# EAGLE schematic tf534 (EAGLE 8.7.0)

## Sheet 1 of 3
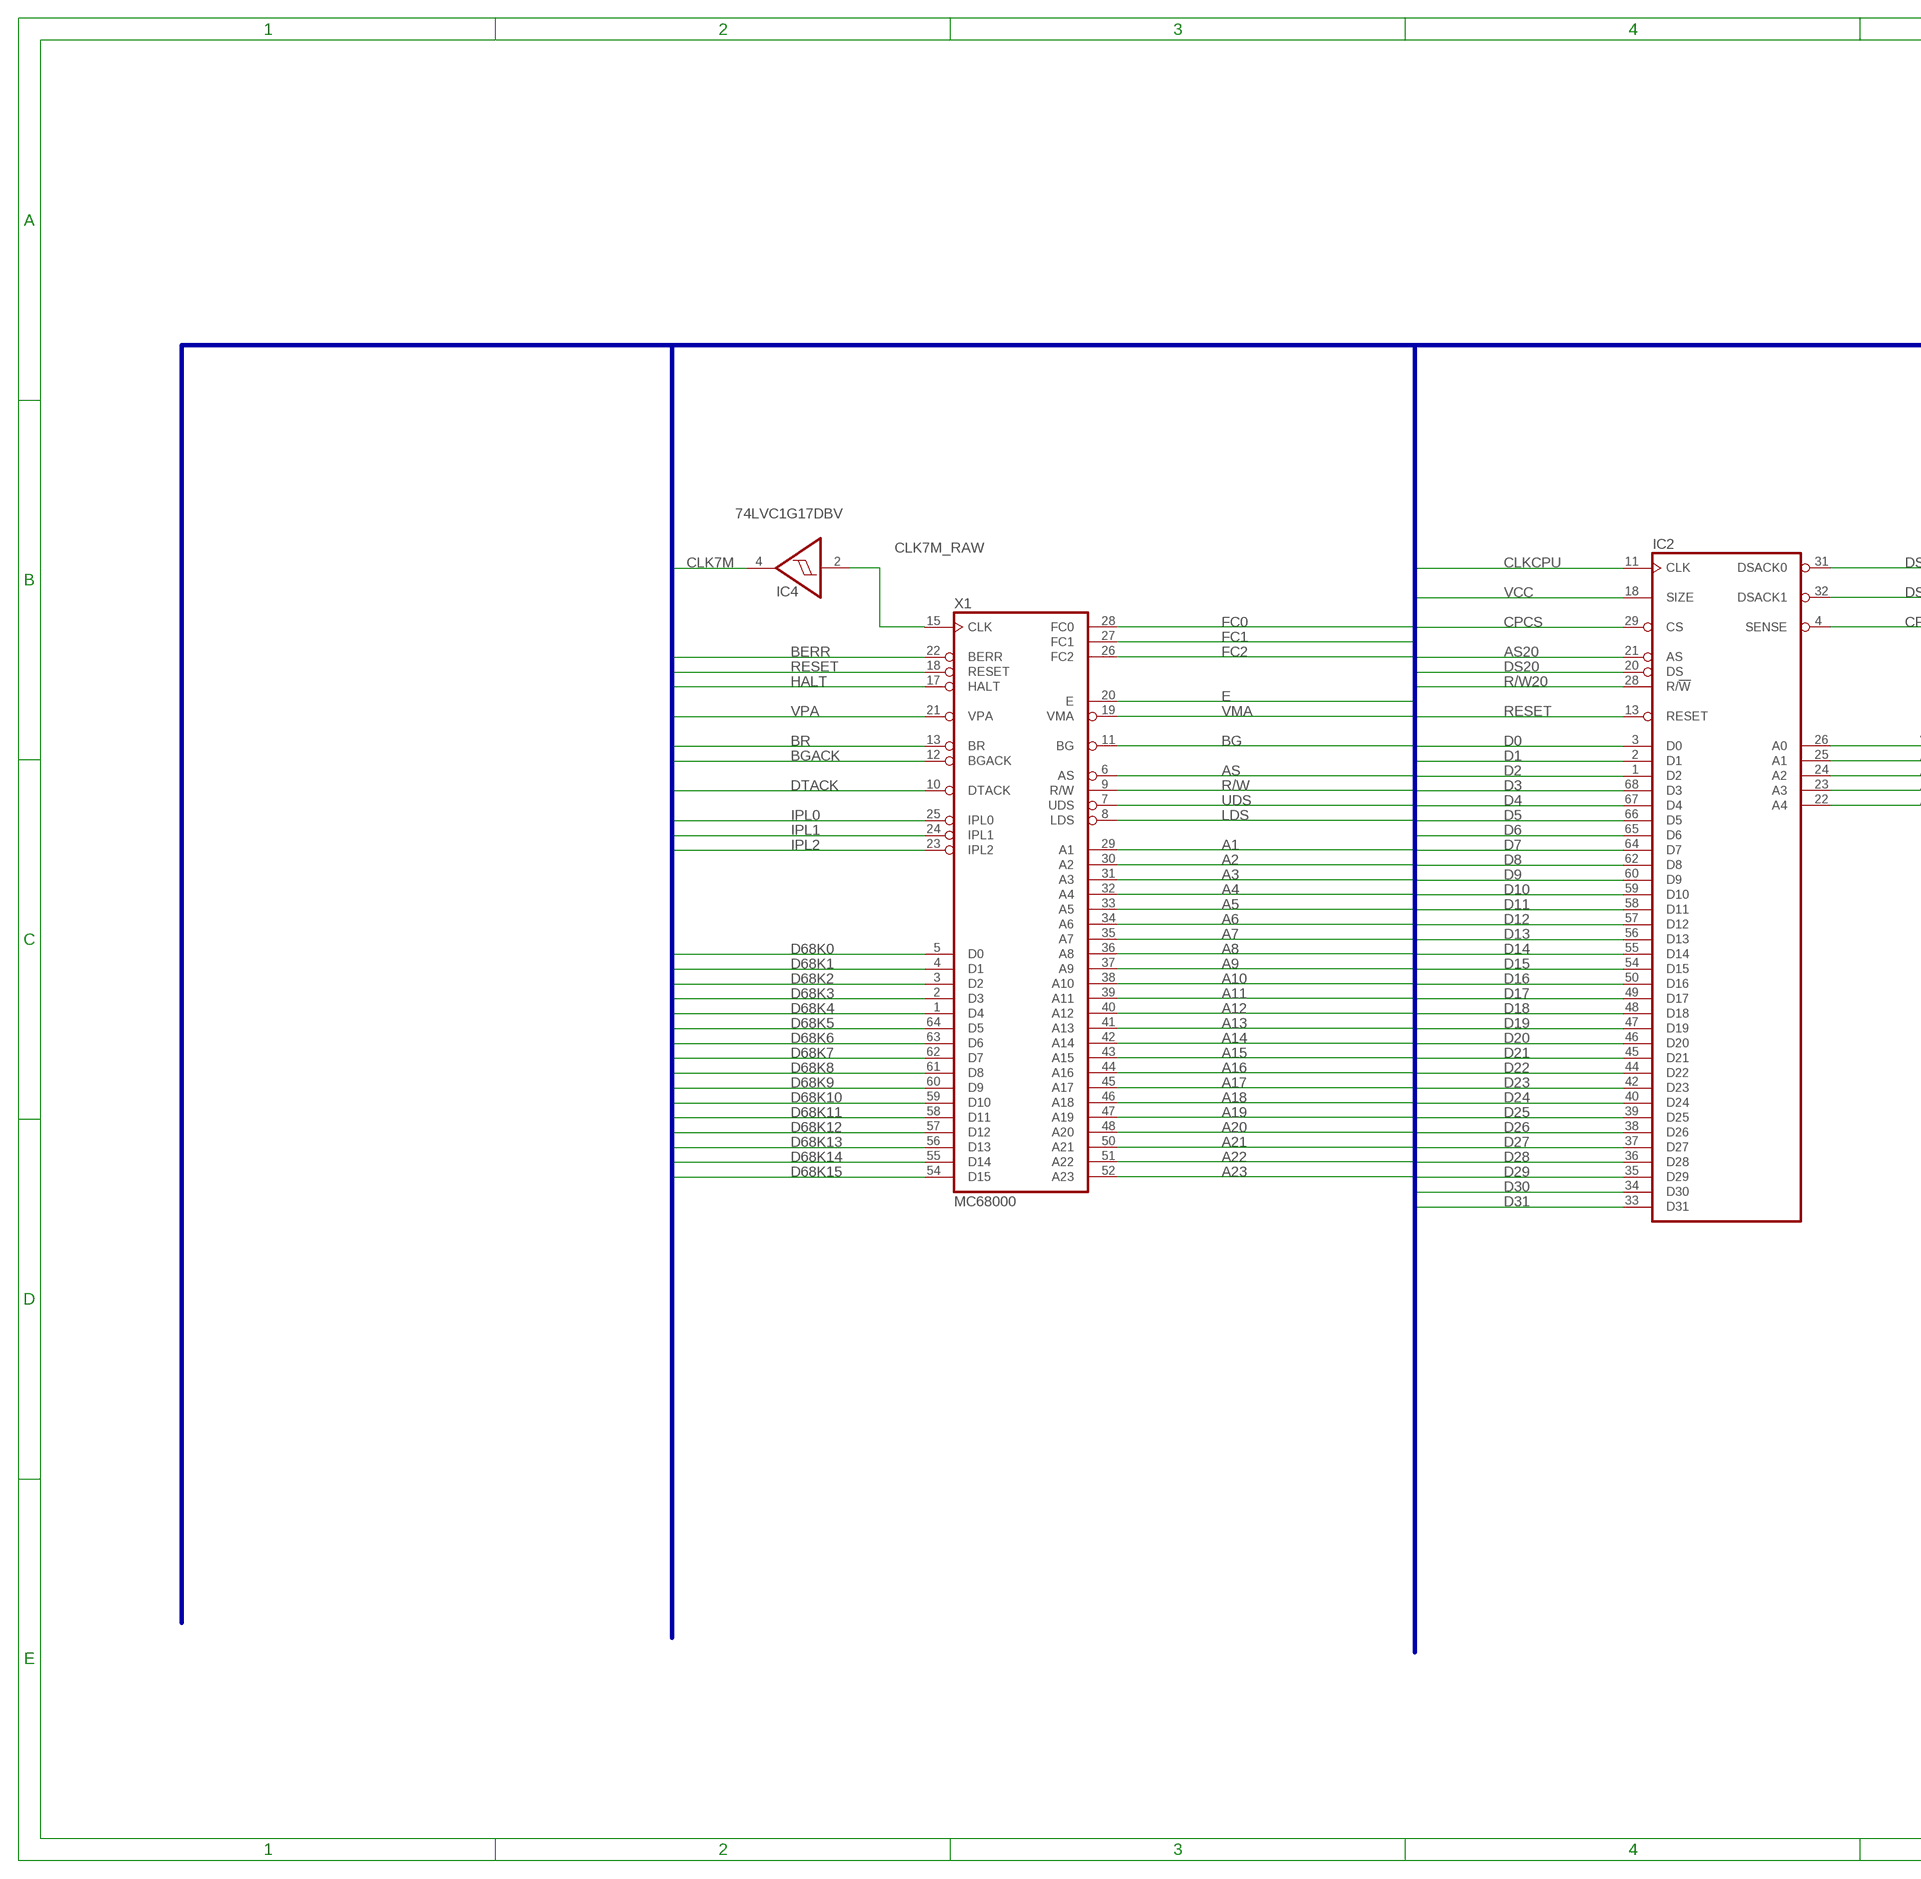
[diagram p0: schematic, sheet 1, part 1 of 2]
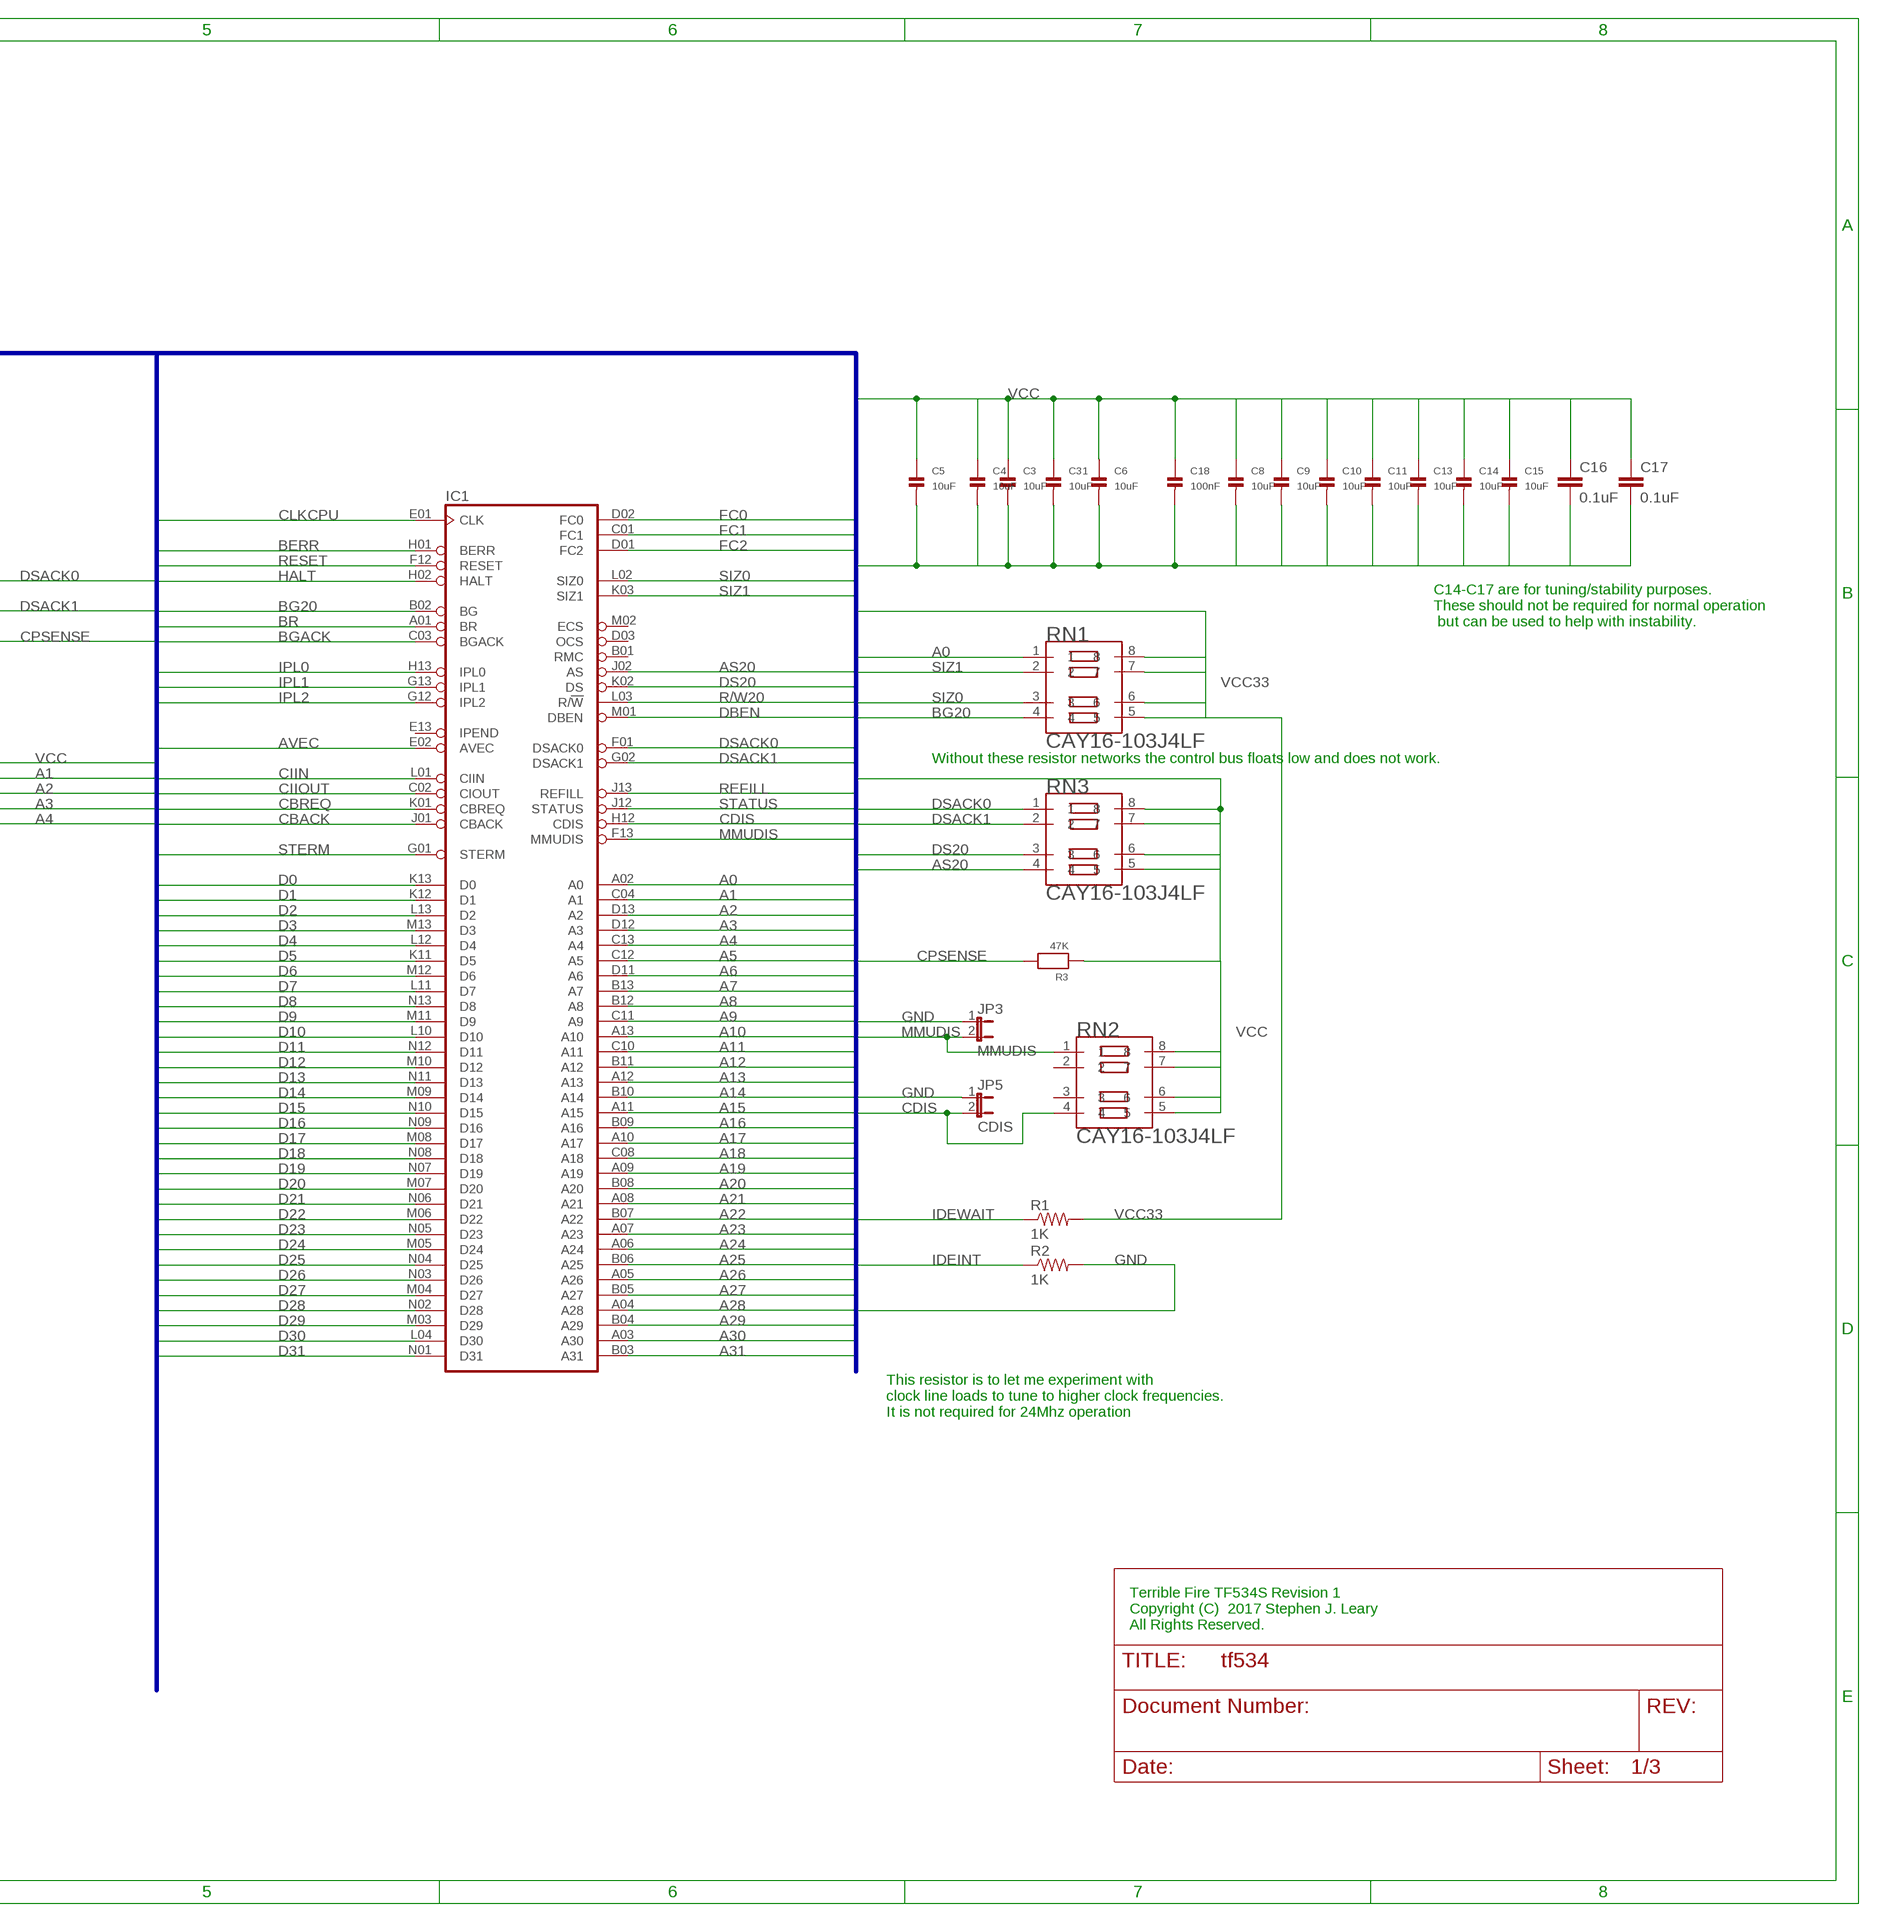
[diagram p1: schematic, sheet 1, part 2 of 2]

### Parts
C3  10uF  CAP_CERAMIC1206  [1206]
C4  10uF  CAP_CERAMIC1206  [1206]
C5  10uF  CAP_CERAMIC1206  [1206]
C6  10uF  CAP_CERAMIC1206  [1206]
C8  10uF  CAP_CERAMIC1206  [1206]
C9  10uF  CAP_CERAMIC1206  [1206]
C10  10uF  CAP_CERAMIC1206  [1206]
C11  10uF  CAP_CERAMIC1206  [1206]
C13  10uF  CAP_CERAMIC1206  [1206]
C14  10uF  CAP_CERAMIC1206  [1206]
C15  10uF  CAP_CERAMIC1206  [1206]
C16  0.1uF  0.1UF-25V(+80/-20%)(0603)  [0603-CAP]
C17  0.1uF  0.1UF-25V(+80/-20%)(0603)  [0603-CAP]
C18  100nF  CAP_CERAMIC1206  [1206]
C31  10uF  CAP_CERAMIC1206  [1206]
IC1  MC68030RC  [MPGA128]
IC2  MC68881FN-SOC  [PLCC68-S]
IC4  74LVC1G17DBV  [SOT23-5]
JP3  MMUDIS  JUMPER-2PTH  [1X02]
JP5  CDIS  JUMPER-2PTH  [1X02]
R1  1K  0.05OHM-1/5W-1%(0603)  [0603]
R2  1K  0.05OHM-1/5W-1%(0603)  [0603]
R3  47K  RESISTOR1206  [1206]
RN1  CAY16-103J4LF  [RESCAXE80P320X160-8N]
RN2  CAY16-103J4LF  [RESCAXE80P320X160-8N]
RN3  CAY16-103J4LF  [RESCAXE80P320X160-8N]
X1  MC68000  MC68000P  [DIL64]

### Nets
A0: IC1.A02(A0) RN1.1 ; also sheet 2
A1: IC1.C04(A1) IC2.25(A1) X1.29(A1) ; also sheet 2
A2: IC1.D13(A2) IC2.24(A2) X1.30(A2) ; also sheet 2,3
A3: IC1.D12(A3) IC2.23(A3) X1.31(A3) ; also sheet 2,3
A4: IC1.C13(A4) IC2.22(A4) X1.32(A4) ; also sheet 2,3
A5: IC1.C12(A5) X1.33(A5) ; also sheet 2
A6: IC1.D11(A6) X1.34(A6) ; also sheet 2
A7: IC1.B13(A7) X1.35(A7) ; also sheet 2
A8: IC1.B12(A8) X1.36(A8) ; also sheet 2
A9: IC1.C11(A9) X1.37(A9) ; also sheet 2
A10: IC1.A13(A10) X1.38(A10) ; also sheet 2
A11: IC1.C10(A11) X1.39(A11) ; also sheet 2
A12: IC1.B11(A12) X1.40(A12) ; also sheet 2
A13: IC1.A12(A13) X1.41(A13) ; also sheet 2
A14: IC1.B10(A14) X1.42(A14) ; also sheet 2
A15: IC1.A11(A15) X1.43(A15) ; also sheet 2
A16: IC1.B09(A16) X1.44(A16) ; also sheet 2
A17: IC1.A10(A17) X1.45(A17) ; also sheet 2
A18: IC1.C08(A18) X1.46(A18) ; also sheet 2
A19: IC1.A09(A19) X1.47(A19) ; also sheet 2
A20: IC1.B08(A20) X1.48(A20) ; also sheet 2
A21: IC1.A08(A21) X1.50(A21) ; also sheet 2
A22: IC1.B07(A22) X1.51(A22) ; also sheet 2
A23: IC1.A07(A23) X1.52(A23) ; also sheet 2
A24: IC1.A06(A24) ; also sheet 2
A25: IC1.B06(A25) ; also sheet 2
A26: IC1.A05(A26) ; also sheet 2
A27: IC1.B05(A27) ; also sheet 2
A28: IC1.A04(A28) ; also sheet 2
A29: IC1.B04(A29) ; also sheet 2
A30: IC1.A03(A30) ; also sheet 2
A31: IC1.B03(A31) ; also sheet 2
AS: X1.6(AS) ; also sheet 2
AS20: IC1.J02(AS) IC2.21(AS) RN3.4 ; also sheet 2
AVEC: IC1.E02(AVEC) ; also sheet 2
BERR: IC1.H01(BERR) X1.22(BERR) ; also sheet 2
BG: X1.11(BG) ; also sheet 2
BG20: IC1.B02(BG) RN1.4 ; also sheet 2
BGACK: IC1.C03(BGACK) X1.12(BGACK) ; also sheet 2
BR: IC1.A01(BR) X1.13(BR)
CBACK: IC1.J01(CBACK) ; also sheet 2
CBREQ: IC1.K01(CBREQ) ; also sheet 2
CDIS: IC1.H12(CDIS) JP5.2 RN2.4
CIIN: IC1.L01(CIIN) ; also sheet 2
CIIOUT: IC1.C02(CIOUT)
CLK7M: IC4.4(O) ; also sheet 2
CLK7M_RAW: IC4.2(I) X1.15(CLK) ; also sheet 2
CLKCPU: IC1.E01(CLK) IC2.11(CLK) ; also sheet 2
CPCS: IC2.29(CS) ; also sheet 2
CPSENSE: IC2.4(SENSE) R3.2 ; also sheet 2
D0: IC1.K13(D0) IC2.3(D0) ; also sheet 2
D1: IC1.K12(D1) IC2.2(D1) ; also sheet 2
D2: IC1.L13(D2) IC2.1(D2) ; also sheet 2
D3: IC1.M13(D3) IC2.68(D3) ; also sheet 2
D4: IC1.L12(D4) IC2.67(D4) ; also sheet 2
D5: IC1.K11(D5) IC2.66(D5) ; also sheet 2
D6: IC1.M12(D6) IC2.65(D6) ; also sheet 2
D7: IC1.L11(D7) IC2.64(D7) ; also sheet 2
D8: IC1.N13(D8) IC2.62(D8) ; also sheet 2
D9: IC1.M11(D9) IC2.60(D9) ; also sheet 2
D10: IC1.L10(D10) IC2.59(D10) ; also sheet 2
D11: IC1.N12(D11) IC2.58(D11) ; also sheet 2
D12: IC1.M10(D12) IC2.57(D12) ; also sheet 2
D13: IC1.N11(D13) IC2.56(D13) ; also sheet 2
D14: IC1.M09(D14) IC2.55(D14) ; also sheet 2
D15: IC1.N10(D15) IC2.54(D15) ; also sheet 2
D16: IC1.N09(D16) IC2.50(D16) ; also sheet 2,3
D17: IC1.M08(D17) IC2.49(D17) ; also sheet 2,3
D18: IC1.N08(D18) IC2.48(D18) ; also sheet 2,3
D19: IC1.N07(D19) IC2.47(D19) ; also sheet 2,3
D20: IC1.M07(D20) IC2.46(D20) ; also sheet 2,3
D21: IC1.N06(D21) IC2.45(D21) ; also sheet 2,3
D22: IC1.M06(D22) IC2.44(D22) ; also sheet 2,3
D23: IC1.N05(D23) IC2.42(D23) ; also sheet 2,3
D24: IC1.M05(D24) IC2.40(D24) ; also sheet 2,3
D25: IC1.N04(D25) IC2.39(D25) ; also sheet 2,3
D26: IC1.N03(D26) IC2.38(D26) ; also sheet 2,3
D27: IC1.M04(D27) IC2.37(D27) ; also sheet 2,3
D28: IC1.N02(D28) IC2.36(D28) ; also sheet 2,3
D29: IC1.M03(D29) IC2.35(D29) ; also sheet 2,3
D30: IC1.L04(D30) IC2.34(D30) ; also sheet 2,3
D31: IC1.N01(D31) IC2.33(D31) ; also sheet 2,3
D68K0: X1.5(D0) ; also sheet 2
D68K1: X1.4(D1) ; also sheet 2
D68K2: X1.3(D2) ; also sheet 2
D68K3: X1.2(D3) ; also sheet 2
D68K4: X1.1(D4) ; also sheet 2
D68K5: X1.64(D5) ; also sheet 2
D68K6: X1.63(D6) ; also sheet 2
D68K7: X1.62(D7) ; also sheet 2
D68K8: X1.61(D8) ; also sheet 2
D68K9: X1.60(D9) ; also sheet 2
D68K10: X1.59(D10) ; also sheet 2
D68K11: X1.58(D11) ; also sheet 2
D68K12: X1.57(D12) ; also sheet 2
D68K13: X1.56(D13) ; also sheet 2
D68K14: X1.55(D14) ; also sheet 2
D68K15: X1.54(D15) ; also sheet 2
DBEN: IC1.M01(DBEN)
DS20: IC1.K02(DS) IC2.20(DS) RN3.3 ; also sheet 2
DSACK0: IC1.F01(DSACK0) IC2.31(DSACK0) RN3.1
DSACK1: IC1.G02(DSACK1) IC2.32(DSACK1) RN3.2 ; also sheet 2
DTACK: X1.10(DTACK) ; also sheet 2
E: X1.20(E) ; also sheet 2
FC0: IC1.D02(FC0) X1.28(FC0) ; also sheet 2
FC1: IC1.C01(FC1) X1.27(FC1) ; also sheet 2
FC2: IC1.D01(FC2) X1.26(FC2) ; also sheet 2
GND: C3.2 C4.2 C5.2 C6.2 C8.2 C9.2 C10.2 C11.2 C13.2 C14.2 C15.2 C16.2 C17.2 C18.2 C31.2 JP3.1 JP5.1 R2.2 ; also sheet 2,3
HALT: IC1.H02(HALT) X1.17(HALT)
IDEINT: R2.1 ; also sheet 2,3
IDEWAIT: R1.1 ; also sheet 2,3
IPL0: IC1.H13(IPL0) X1.25(IPL0)
IPL1: IC1.G13(IPL1) X1.24(IPL1) ; also sheet 2
IPL2: IC1.G12(IPL2) X1.23(IPL2) ; also sheet 2
LDS: X1.8(LDS) ; also sheet 2
MMUDIS: IC1.F13(MMUDIS) JP3.2 RN2.1
R/W: X1.9(R/W) ; also sheet 2
R/W20: IC1.L03(R/!W) IC2.28(R/!W) ; also sheet 2
REFILL: IC1.J13(REFILL)
RESET: IC1.F12(RESET) IC2.13(RESET) X1.18(RESET) ; also sheet 2,3
SIZ0: IC1.L02(SIZ0) RN1.3 ; also sheet 2
SIZ1: IC1.K03(SIZ1) RN1.2 ; also sheet 2
STATUS: IC1.J12(STATUS)
STERM: IC1.G01(STERM) ; also sheet 2
UDS: X1.7(UDS) ; also sheet 2
VCC: C3.1 C4.1 C5.1 C6.1 C8.1 C9.1 C10.1 C11.1 C13.1 C14.1 C15.1 C16.1 C17.1 C18.1 C31.1 IC2.18(SIZE) IC2.26(A0) R3.1 RN2.5 RN2.6 RN2.7 RN2.8 RN3.5 RN3.6 RN3.7 RN3.8 ; also sheet 2,3
VCC33: R1.2 RN1.5 RN1.6 RN1.7 RN1.8 ; also sheet 2
VMA: X1.19(VMA) ; also sheet 2
VPA: X1.21(VPA) ; also sheet 2
Unconnected: IC1.B01(RMC) IC1.D03(OCS) IC1.E13(IPEND) IC1.M02(ECS) RN2.2 RN2.3

### Buses
VCC18,VCC33,VCC,GND,AGND,CLK7M,A[0..31],BURST[2..3],D[0..31],D68K[0..15],IPL[0..2],FC[0..2],DSACK[0..1],BR,BGACK,R/W20,R/W,CLKCPU,AS20,DS20,BG20,AVEC,SIZ[0..1],DBEN,BERR,RESET,HALT,BG,VPA,VMA,E,AS,UDS,LDS,DTACK,CPCS,CPSENSE,CDIS,MMUDIS,IOR,IOW,INT2,IDECS[0..1],IDEIOEN,IDELED,IDEWAIT,IDEINT,RAMOE,RAMCS[0..3],INTCYCLE,TCK,TMS,TDI,TDO,TDINT,OVL,CIIN,CIIOUT,CBREQ,CBACK,STERM,STATUS,REFILL,SPI_MOSI,SPI_MISO,SPI_CLK,SPI_CS[0..1],SPARE,BUSEN

### Notes on the sheet
- C14-C17 are for tuning/stability purposes. 
  These should not be required for normal operation
   but can be used to help with instability.
- Without these resistor networks the control bus floats low and does not work.
- This resistor is to let me experiment with 
  clock line loads to tune to higher clock frequencies. 
  It is not required for 24Mhz operation
- Terrible Fire TF534S Revision 1 
  Copyright (C)  2017 Stephen J. Leary
  All Rights Reserved.

## Sheet 2 of 3
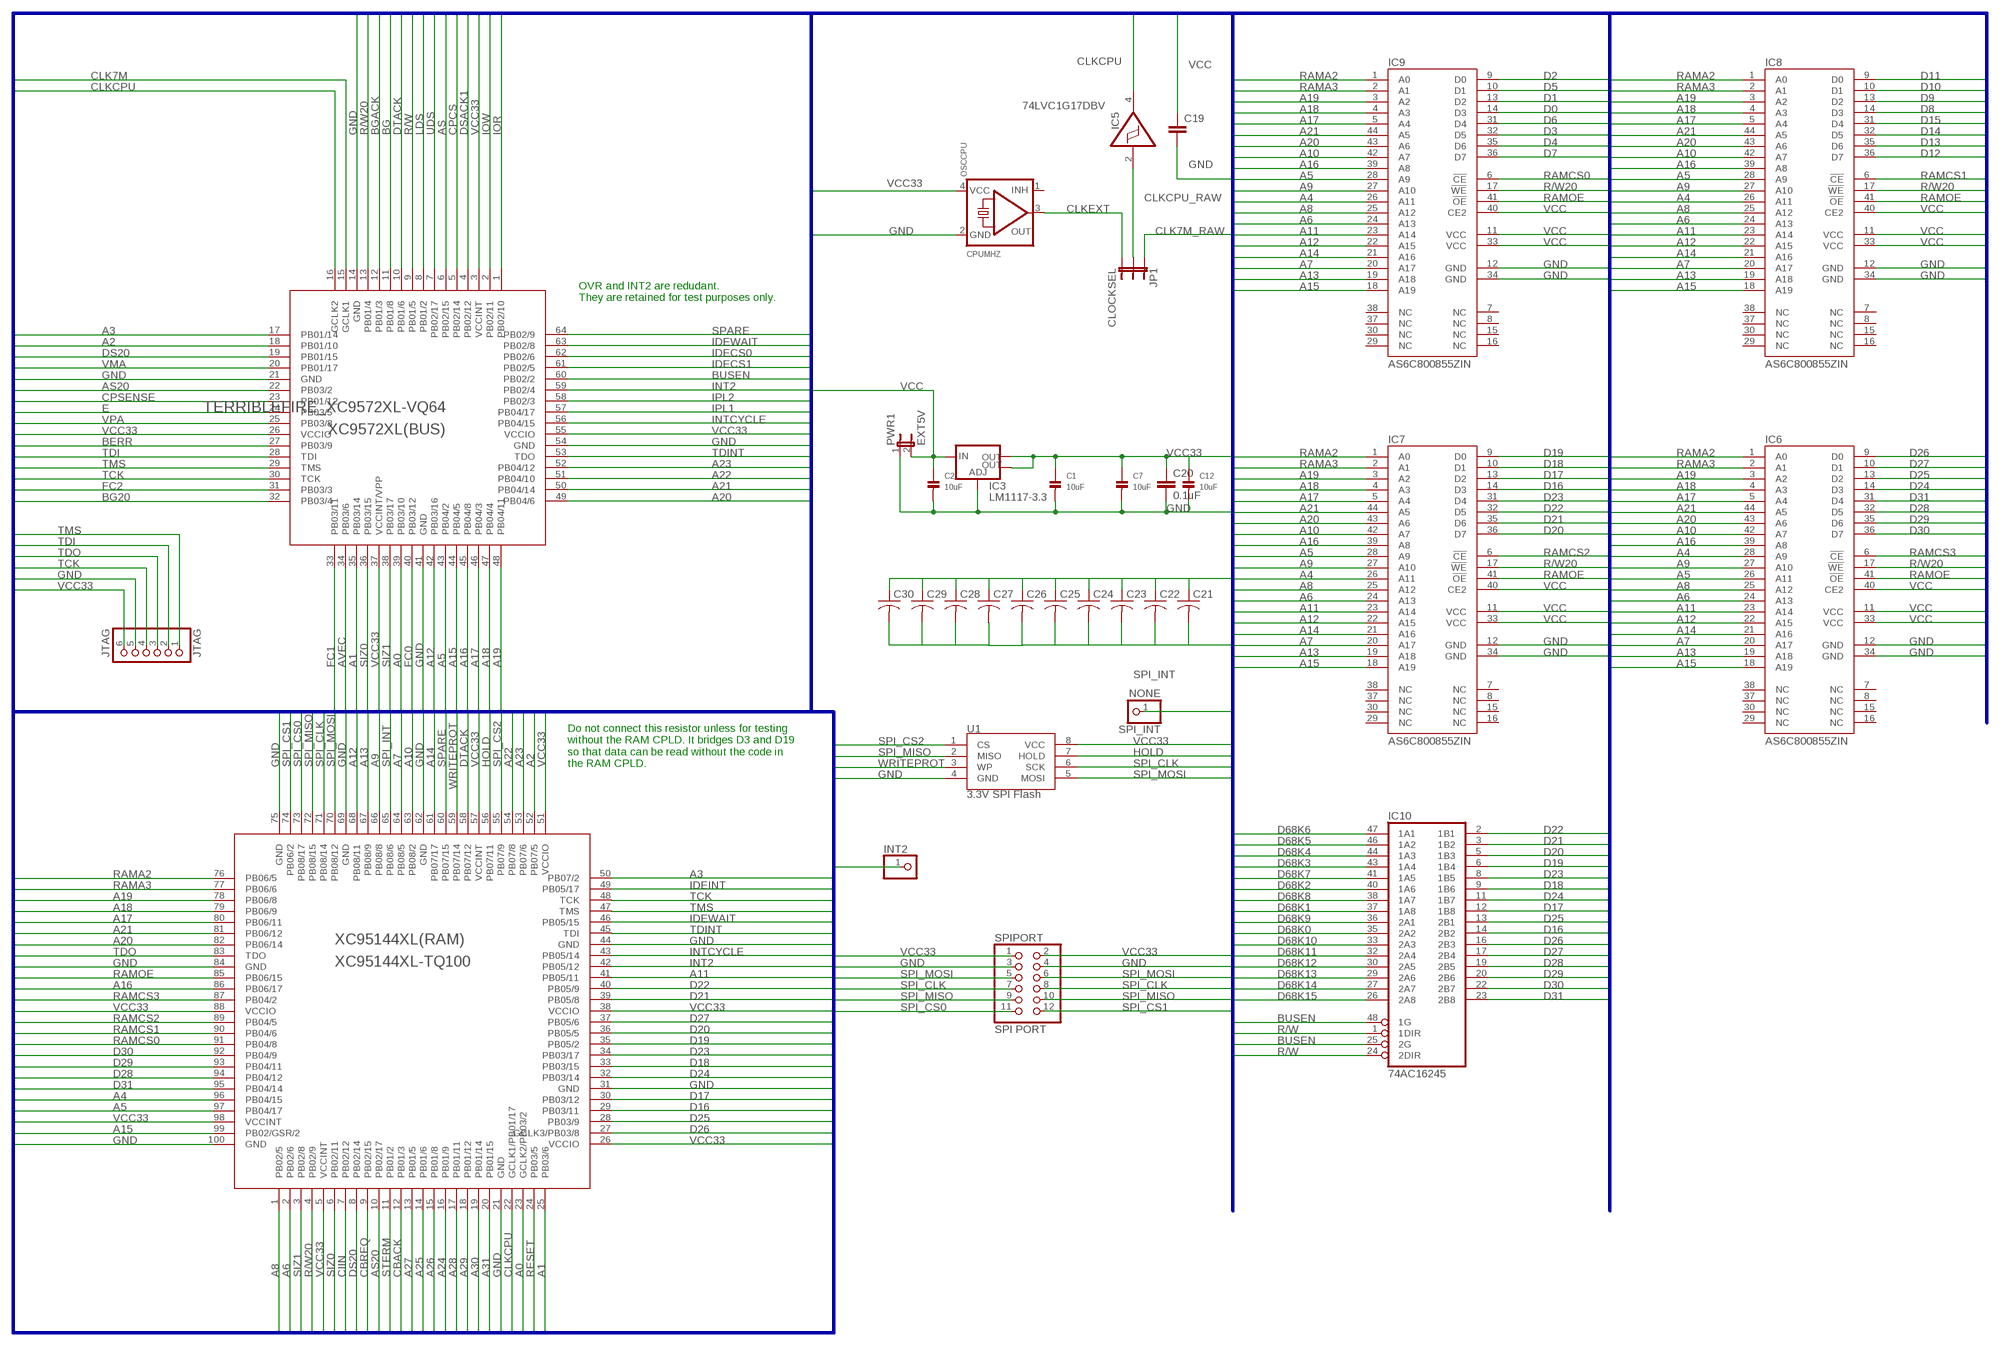
[diagram p2: schematic, sheet 2]

### Parts
C1  10uF  CAP_CERAMIC1206  [1206]
C2  10uF  CAP_CERAMIC1206  [1206]
C7  10uF  CAP_CERAMIC1206  [1206]
C12  10uF  CAP_CERAMIC1206  [1206]
C19  CC0603  [C0603]
C20  0.1uF  0.1UF-25V(+80/-20%)(0603)  [0603-CAP]
C21  C-USC0603  [C0603]
C22  C-USC0603  [C0603]
C23  C-USC0603  [C0603]
C24  C-USC0603  [C0603]
C25  C-USC0603  [C0603]
C26  C-USC0603  [C0603]
C27  C-USC0603  [C0603]
C28  C-USC0603  [C0603]
C29  C-USC0603  [C0603]
C30  C-USC0603  [C0603]
IC3  LM1117-3.3  V_REG_LM1117SOT223  [SOT223]
IC5  74LVC1G17DBV  [SOT23-5]
IC6  AS6C800855ZIN  [TSOP44-II]
IC7  AS6C800855ZIN  [TSOP44-II]
IC8  AS6C800855ZIN  [TSOP44-II]
IC9  AS6C800855ZIN  [TSOP44-II]
IC10  74AC16245  [SSOP48DL]
INT2  PINHD-1X1  [1X01]
JP1  CLOCKSEL  JUMPER-3PTH  [1X03]
JTAG  JTAG  HEADER-1X6ROUND  [1X06_ROUND]
OSCCPU  CPUMHZ  OSCILLATOR  [OSC_7X5MM]
PWR1  EXT5V  JUMPER-2PTH  [1X02]
SPI_INT  NONE  PINHD-1X1  [1X01]
SPIPORT  SPI PORT  PINHD-2X6  [2X06]
U1  3.3V SPI Flash  SPI_FLASH-X25XXSMD  [SO08]
XC9572XL(BUS)  TERRIBLEFIRE_XC9572XL-VQ64  [TERRIBLEFIRE_VQ64]
XC95144XL(RAM)  XC95144XL-TQ100  [TQFP100]

### Nets
A0: XC9572XL(BUS).39(PB03/10) XC95144XL(RAM).23(GCLK2/PB03/2) ; also sheet 1
A1: XC9572XL(BUS).35(PB03/14) XC95144XL(RAM).25(PB03/6) ; also sheet 1
A2: XC9572XL(BUS).18(PB01/10) XC95144XL(RAM).52(PB07/5) ; also sheet 1,3
A3: XC9572XL(BUS).17(PB01/14) XC95144XL(RAM).50(PB07/2) ; also sheet 1,3
A4: IC6.28(A9) IC7.26(A11) IC8.26(A11) IC9.26(A11) XC95144XL(RAM).96(PB04/15) ; also sheet 1,3
A5: IC6.26(A11) IC7.28(A9) IC8.28(A9) IC9.28(A9) XC9572XL(BUS).43(PB04/2) XC95144XL(RAM).97(PB04/17) ; also sheet 1
A6: IC6.24(A13) IC7.24(A13) IC8.24(A13) IC9.24(A13) XC95144XL(RAM).2(PB02/6) ; also sheet 1
A7: IC6.20(A17) IC7.20(A17) IC8.20(A17) IC9.20(A17) XC95144XL(RAM).64(PB08/5) ; also sheet 1
A8: IC6.25(A12) IC7.25(A12) IC8.25(A12) IC9.25(A12) XC95144XL(RAM).1(PB02/5) ; also sheet 1
A9: IC6.27(A10) IC7.27(A10) IC8.27(A10) IC9.27(A10) XC95144XL(RAM).66(PB08/8) ; also sheet 1
A10: IC6.42(A7) IC7.42(A7) IC8.42(A7) IC9.42(A7) XC95144XL(RAM).63(PB08/2) ; also sheet 1
A11: IC6.23(A14) IC7.23(A14) IC8.23(A14) IC9.23(A14) XC95144XL(RAM).41(PB05/11) ; also sheet 1
A12: IC6.22(A15) IC7.22(A15) IC8.22(A15) IC9.22(A15) XC9572XL(BUS).42(PB03/16) XC95144XL(RAM).68(PB08/11) ; also sheet 1
A13: IC6.19(A18) IC7.19(A18) IC8.19(A18) IC9.19(A18) XC95144XL(RAM).67(PB08/9) ; also sheet 1
A14: IC6.21(A16) IC7.21(A16) IC8.21(A16) IC9.21(A16) XC95144XL(RAM).61(PB07/17) ; also sheet 1
A15: IC6.18(A19) IC7.18(A19) IC8.18(A19) IC9.18(A19) XC9572XL(BUS).44(PB04/5) XC95144XL(RAM).99(PB02/GSR/2) ; also sheet 1
A16: IC6.39(A8) IC7.39(A8) IC8.39(A8) IC9.39(A8) XC9572XL(BUS).45(PB04/8) XC95144XL(RAM).86(PB06/17) ; also sheet 1
A17: IC6.5(A4) IC7.5(A4) IC8.5(A4) IC9.5(A4) XC9572XL(BUS).46(PB04/3) XC95144XL(RAM).80(PB06/11) ; also sheet 1
A18: IC6.4(A3) IC7.4(A3) IC8.4(A3) IC9.4(A3) XC9572XL(BUS).47(PB04/4) XC95144XL(RAM).79(PB06/9) ; also sheet 1
A19: IC6.3(A2) IC7.3(A2) IC8.3(A2) IC9.3(A2) XC9572XL(BUS).48(PB04/11) XC95144XL(RAM).78(PB06/8) ; also sheet 1
A20: IC6.43(A6) IC7.43(A6) IC8.43(A6) IC9.43(A6) XC9572XL(BUS).49(PB04/6) XC95144XL(RAM).82(PB06/14) ; also sheet 1
A21: IC6.44(A5) IC7.44(A5) IC8.44(A5) IC9.44(A5) XC9572XL(BUS).50(PB04/14) XC95144XL(RAM).81(PB06/12) ; also sheet 1
A22: XC9572XL(BUS).51(PB04/10) XC95144XL(RAM).54(PB07/8) ; also sheet 1
A23: XC9572XL(BUS).52(PB04/12) XC95144XL(RAM).53(PB07/6) ; also sheet 1
A24: XC95144XL(RAM).16(PB01/9) ; also sheet 1
A25: XC95144XL(RAM).14(PB01/6) ; also sheet 1
A26: XC95144XL(RAM).15(PB01/8) ; also sheet 1
A27: XC95144XL(RAM).13(PB01/5) ; also sheet 1
A28: XC95144XL(RAM).17(PB01/11) ; also sheet 1
A29: XC95144XL(RAM).18(PB01/12) ; also sheet 1
A30: XC95144XL(RAM).19(PB01/14) ; also sheet 1
A31: XC95144XL(RAM).20(PB01/15) ; also sheet 1
AS: XC9572XL(BUS).6(PB02/15) ; also sheet 1
AS20: XC9572XL(BUS).22(PB03/2) XC95144XL(RAM).10(PB02/17) ; also sheet 1
AVEC: XC9572XL(BUS).34(PB03/6) ; also sheet 1
BERR: XC9572XL(BUS).27(PB03/9) ; also sheet 1
BG: XC9572XL(BUS).11(PB01/8) ; also sheet 1
BG20: XC9572XL(BUS).32(PB03/4) ; also sheet 1
BGACK: XC9572XL(BUS).12(PB01/3) ; also sheet 1
BUSEN: IC10.25(2G) IC10.48(1G) XC9572XL(BUS).60(PB02/2)
CBACK: XC95144XL(RAM).12(PB01/3) ; also sheet 1
CBREQ: XC95144XL(RAM).9(PB02/15) ; also sheet 1
CIIN: XC95144XL(RAM).7(PB02/12) ; also sheet 1
CLK7M: XC9572XL(BUS).15(GCLK1) ; also sheet 1
CLK7M_RAW: JP1.1 ; also sheet 1
CLKCPU: IC5.4(O) XC9572XL(BUS).16(GCLK2) XC95144XL(RAM).22(GCLK1/PB01/17) ; also sheet 1
CLKCPU_RAW: IC5.2(I) JP1.2
CLKEXT: JP1.3 OSCCPU.3(OUT)
CPCS: XC9572XL(BUS).5(PB02/14) ; also sheet 1
CPSENSE: XC9572XL(BUS).23(PB01/12) ; also sheet 1
D0: IC9.14(D3) ; also sheet 1
D1: IC9.13(D2) ; also sheet 1
D2: IC9.9(D0) ; also sheet 1
D3: IC9.32(D5) ; also sheet 1
D4: IC9.35(D6) ; also sheet 1
D5: IC9.10(D1) ; also sheet 1
D6: IC9.31(D4) ; also sheet 1
D7: IC9.36(D7) ; also sheet 1
D8: IC8.14(D3) ; also sheet 1
D9: IC8.13(D2) ; also sheet 1
D10: IC8.10(D1) ; also sheet 1
D11: IC8.9(D0) ; also sheet 1
D12: IC8.36(D7) ; also sheet 1
D13: IC8.35(D6) ; also sheet 1
D14: IC8.32(D5) ; also sheet 1
D15: IC8.31(D4) ; also sheet 1
D16: IC7.14(D3) IC10.14(2B2) XC95144XL(RAM).29(PB03/11) ; also sheet 1,3
D17: IC7.13(D2) IC10.12(1B8) XC95144XL(RAM).30(PB03/12) ; also sheet 1,3
D18: IC7.10(D1) IC10.9(1B6) XC95144XL(RAM).33(PB03/15) ; also sheet 1,3
D19: IC7.9(D0) IC10.6(1B4) XC95144XL(RAM).35(PB05/2) ; also sheet 1,3
D20: IC7.36(D7) IC10.5(1B3) XC95144XL(RAM).36(PB05/5) ; also sheet 1,3
D21: IC7.35(D6) IC10.3(1B2) XC95144XL(RAM).39(PB05/8) ; also sheet 1,3
D22: IC7.32(D5) IC10.2(1B1) XC95144XL(RAM).40(PB05/9) ; also sheet 1,3
D23: IC7.31(D4) IC10.8(1B5) XC95144XL(RAM).34(PB03/17) ; also sheet 1,3
D24: IC6.14(D3) IC10.11(1B7) XC95144XL(RAM).32(PB03/14) ; also sheet 1,3
D25: IC6.13(D2) IC10.13(2B1) XC95144XL(RAM).28(PB03/9) ; also sheet 1,3
D26: IC6.9(D0) IC10.16(2B3) XC95144XL(RAM).27(GCLK3/PB03/8) ; also sheet 1,3
D27: IC6.10(D1) IC10.17(2B4) XC95144XL(RAM).37(PB05/6) ; also sheet 1,3
D28: IC6.32(D5) IC10.19(2B5) XC95144XL(RAM).94(PB04/12) ; also sheet 1,3
D29: IC6.35(D6) IC10.20(2B6) XC95144XL(RAM).93(PB04/11) ; also sheet 1,3
D30: IC6.36(D7) IC10.22(2B7) XC95144XL(RAM).92(PB04/9) ; also sheet 1,3
D31: IC6.31(D4) IC10.23(2B8) XC95144XL(RAM).95(PB04/14) ; also sheet 1,3
D68K0: IC10.35(2A2) ; also sheet 1
D68K1: IC10.37(1A8) ; also sheet 1
D68K2: IC10.40(1A6) ; also sheet 1
D68K3: IC10.43(1A4) ; also sheet 1
D68K4: IC10.44(1A3) ; also sheet 1
D68K5: IC10.46(1A2) ; also sheet 1
D68K6: IC10.47(1A1) ; also sheet 1
D68K7: IC10.41(1A5) ; also sheet 1
D68K8: IC10.38(1A7) ; also sheet 1
D68K9: IC10.36(2A1) ; also sheet 1
D68K10: IC10.33(2A3) ; also sheet 1
D68K11: IC10.32(2A4) ; also sheet 1
D68K12: IC10.30(2A5) ; also sheet 1
D68K13: IC10.29(2A6) ; also sheet 1
D68K14: IC10.27(2A7) ; also sheet 1
D68K15: IC10.26(2A8) ; also sheet 1
DS20: XC9572XL(BUS).19(PB01/15) XC95144XL(RAM).8(PB02/14) ; also sheet 1
DSACK1: XC9572XL(BUS).4(PB02/12) ; also sheet 1
DTACK: XC9572XL(BUS).10(PB01/6) XC95144XL(RAM).58(PB07/12) ; also sheet 1
E: XC9572XL(BUS).24(PB03/5) ; also sheet 1
FC0: XC9572XL(BUS).40(PB03/12) ; also sheet 1
FC1: XC9572XL(BUS).33(PB03/11) ; also sheet 1
FC2: XC9572XL(BUS).31(PB03/3) ; also sheet 1
GND: C1.2 C2.2 C7.2 C12.2 C19.2 C20.2 C21.2 C22.2 C23.2 C24.2 C25.2 C26.2 C27.2 C28.2 C29.2 C30.2 IC3.1(ADJ) IC6.12(GND) IC6.34(GND) IC7.12(GND) IC7.34(GND) IC8.12(GND) IC8.34(GND) IC9.12(GND) IC9.34(GND) JTAG.5 OSCCPU.2(GND) PWR1.1 SPIPORT.3 SPIPORT.4 U1.4(GND) XC9572XL(BUS).14(GND) XC9572XL(BUS).21(GND) XC9572XL(BUS).41(GND) XC9572XL(BUS).54(GND) XC95144XL(RAM).21(GND) XC95144XL(RAM).31(GND) XC95144XL(RAM).44(GND) XC95144XL(RAM).62(GND) XC95144XL(RAM).69(GND) XC95144XL(RAM).75(GND) XC95144XL(RAM).84(GND) XC95144XL(RAM).100(GND) ; also sheet 1,3
HOLD: U1.7(HOLD) XC95144XL(RAM).56(PB07/11)
IDECS0: XC9572XL(BUS).62(PB02/6) ; also sheet 3
IDECS1: XC9572XL(BUS).61(PB02/5) ; also sheet 3
IDEINT: XC95144XL(RAM).49(PB05/17) ; also sheet 1,3
IDEWAIT: XC9572XL(BUS).63(PB02/8) XC95144XL(RAM).46(PB05/15) ; also sheet 1,3
INT2: INT2.1 XC9572XL(BUS).59(PB02/4) XC95144XL(RAM).42(PB05/12)
INTCYCLE: XC9572XL(BUS).56(PB04/15) XC95144XL(RAM).43(PB05/14)
IOR: XC9572XL(BUS).1(PB02/10) ; also sheet 3
IOW: XC9572XL(BUS).2(PB02/11) ; also sheet 3
IPL1: XC9572XL(BUS).57(PB04/17) ; also sheet 1
IPL2: XC9572XL(BUS).58(PB02/3) ; also sheet 1
LDS: XC9572XL(BUS).8(PB01/2) ; also sheet 1
R/W: IC10.1(1DIR) IC10.24(2DIR) XC9572XL(BUS).9(PB01/5) ; also sheet 1
R/W20: IC6.17(!WE) IC7.17(!WE) IC8.17(!WE) IC9.17(!WE) XC9572XL(BUS).13(PB01/4) XC95144XL(RAM).4(PB02/9) ; also sheet 1
RAMA2: IC6.1(A0) IC7.1(A0) IC8.1(A0) IC9.1(A0) XC95144XL(RAM).76(PB06/5)
RAMA3: IC6.2(A1) IC7.2(A1) IC8.2(A1) IC9.2(A1) XC95144XL(RAM).77(PB06/6)
RAMCS0: IC9.6(!CE) XC95144XL(RAM).91(PB04/8)
RAMCS1: IC8.6(!CE) XC95144XL(RAM).90(PB04/6)
RAMCS2: IC7.6(!CE) XC95144XL(RAM).89(PB04/5)
RAMCS3: IC6.6(!CE) XC95144XL(RAM).87(PB04/2)
RAMOE: IC6.41(!OE) IC7.41(!OE) IC8.41(!OE) IC9.41(!OE) XC95144XL(RAM).85(PB06/15)
RESET: XC95144XL(RAM).24(PB03/5) ; also sheet 1,3
SIZ0: XC9572XL(BUS).36(PB03/15) XC95144XL(RAM).6(PB02/11) ; also sheet 1
SIZ1: XC9572XL(BUS).38(PB03/17) XC95144XL(RAM).3(PB02/8) ; also sheet 1
SPARE: XC9572XL(BUS).64(PB02/9) XC95144XL(RAM).60(PB07/15)
SPI_CLK: SPIPORT.7 SPIPORT.8 U1.6(SCK) XC95144XL(RAM).71(PB08/14)
SPI_CS0: SPIPORT.11 XC95144XL(RAM).73(PB08/17)
SPI_CS1: SPIPORT.12 XC95144XL(RAM).74(PB06/2)
SPI_CS2: U1.1(CS) XC95144XL(RAM).55(PB07/9)
SPI_INT: SPI_INT.1 XC95144XL(RAM).65(PB08/6)
SPI_MISO: SPIPORT.9 SPIPORT.10 U1.2(MISO) XC95144XL(RAM).72(PB08/15)
SPI_MOSI: SPIPORT.5 SPIPORT.6 U1.5(MOSI) XC95144XL(RAM).70(PB08/12)
STERM: XC95144XL(RAM).11(PB01/2) ; also sheet 1
TCK: JTAG.4 XC9572XL(BUS).30(TCK) XC95144XL(RAM).48(TCK)
TDI: JTAG.2 XC9572XL(BUS).28(TDI)
TDINT: XC9572XL(BUS).53(TDO) XC95144XL(RAM).45(TDI)
TDO: JTAG.3 XC95144XL(RAM).83(TDO)
TMS: JTAG.1 XC9572XL(BUS).29(TMS) XC95144XL(RAM).47(TMS)
UDS: XC9572XL(BUS).7(PB02/17) ; also sheet 1
VCC: C2.1 C19.1 IC3.3(IN) IC6.11(VCC) IC6.33(VCC) IC6.40(CE2) IC7.11(VCC) IC7.33(VCC) IC7.40(CE2) IC8.11(VCC) IC8.33(VCC) IC8.40(CE2) IC9.11(VCC) IC9.33(VCC) IC9.40(CE2) PWR1.2 ; also sheet 1,3
VCC33: C1.1 C7.1 C12.1 C20.1 C21.1 C22.1 C23.1 C24.1 C25.1 C26.1 C27.1 C28.1 C29.1 C30.1 IC3.2(OUT) IC3.4(OUT) JTAG.6 OSCCPU.4(VCC) SPIPORT.1 SPIPORT.2 U1.8(VCC) XC9572XL(BUS).3(VCCINT) XC9572XL(BUS).26(VCCIO) XC9572XL(BUS).37(VCCINT/VPP) XC9572XL(BUS).55(VCCIO) XC95144XL(RAM).5(VCCINT) XC95144XL(RAM).26(VCCIO) XC95144XL(RAM).38(VCCIO) XC95144XL(RAM).51(VCCIO) XC95144XL(RAM).57(VCCINT) XC95144XL(RAM).88(VCCIO) XC95144XL(RAM).98(VCCINT) ; also sheet 1
VMA: XC9572XL(BUS).20(PB01/17) ; also sheet 1
VPA: XC9572XL(BUS).25(PB03/8) ; also sheet 1
WRITEPROT: U1.3(WP) XC95144XL(RAM).59(PB07/14)
Unconnected: IC6.7(NC) IC6.8(NC) IC6.15(NC) IC6.16(NC) IC6.29(NC) IC6.30(NC) IC6.37(NC) IC6.38(NC) IC7.7(NC) IC7.8(NC) IC7.15(NC) IC7.16(NC) IC7.29(NC) IC7.30(NC) IC7.37(NC) IC7.38(NC) IC8.7(NC) IC8.8(NC) IC8.15(NC) IC8.16(NC) IC8.29(NC) IC8.30(NC) IC8.37(NC) IC8.38(NC) IC9.7(NC) IC9.8(NC) IC9.15(NC) IC9.16(NC) IC9.29(NC) IC9.30(NC) IC9.37(NC) IC9.38(NC) OSCCPU.1(INH)

### Buses
VCC18,VCC33,VCC,GND,AGND,CLK7M,A[0..31],BURST[2..3],D[0..31],D68K[0..15],IPL[0..2],FC[0..2],DSACK[0..1],BR,BGACK,R/W20,R/W,CLKCPU,CLK7M_RAW,AS20,DS20,BG20,AVEC,SIZ[0..1],DBEN,BERR,RESET,HALT,BG,VPA,VMA,E,AS,UDS,LDS,DTACK,CPCS,CPSENSE,CDIS,MMUDIS,IOR,IOW,INT2,IDECS[0..1],IDEIOEN,IDELED,IDEWAIT,IDEINT,RAMOE,RAMCS[0..3],INTCYCLE,TCK,TMS,TDI,TDO,TDINT,OVL,CIIN,CIIOUT,CBREQ,CBACK,STERM,STATUS,REFILL,SPI_MOSI,SPI_MISO,SPI_CLK,SPI_CS[0..2],SPI_INT,SPARE,BUSEN,HOLD,WRITEPROT,DD3,ROMEN[0..1]

### Notes on the sheet
- OVR and INT2 are redudant.
  They are retained for test purposes only.
- Do not connect this resistor unless for testing 
  without the RAM CPLD. It bridges D3 and D19 
  so that data can be read without the code in 
  the RAM CPLD.

## Sheet 3 of 3
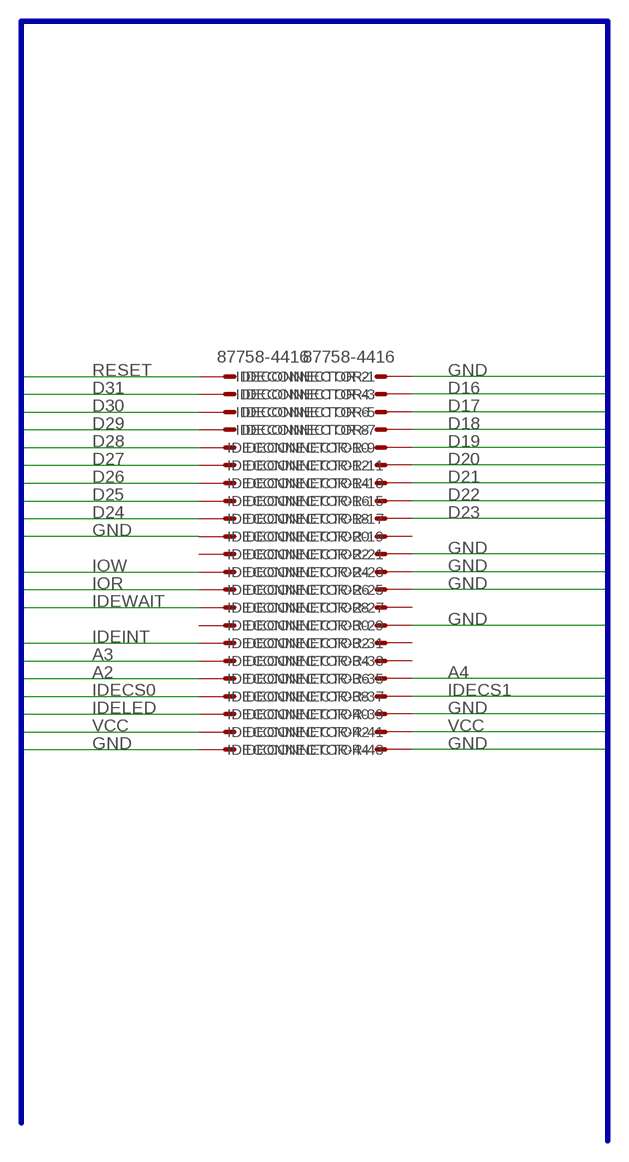
[diagram p3: schematic, sheet 3]

### Parts
IDECONNECTOR  87758-4416  [87758-4416]

### Nets
A2: IDECONNECTOR.35 ; also sheet 1,2
A3: IDECONNECTOR.33 ; also sheet 1,2
A4: IDECONNECTOR.36 ; also sheet 1,2
D16: IDECONNECTOR.4 ; also sheet 1,2
D17: IDECONNECTOR.6 ; also sheet 1,2
D18: IDECONNECTOR.8 ; also sheet 1,2
D19: IDECONNECTOR.10 ; also sheet 1,2
D20: IDECONNECTOR.12 ; also sheet 1,2
D21: IDECONNECTOR.14 ; also sheet 1,2
D22: IDECONNECTOR.16 ; also sheet 1,2
D23: IDECONNECTOR.18 ; also sheet 1,2
D24: IDECONNECTOR.17 ; also sheet 1,2
D25: IDECONNECTOR.15 ; also sheet 1,2
D26: IDECONNECTOR.13 ; also sheet 1,2
D27: IDECONNECTOR.11 ; also sheet 1,2
D28: IDECONNECTOR.9 ; also sheet 1,2
D29: IDECONNECTOR.7 ; also sheet 1,2
D30: IDECONNECTOR.5 ; also sheet 1,2
D31: IDECONNECTOR.3 ; also sheet 1,2
GND: IDECONNECTOR.2 IDECONNECTOR.19 IDECONNECTOR.22 IDECONNECTOR.24 IDECONNECTOR.26 IDECONNECTOR.30 IDECONNECTOR.40 IDECONNECTOR.43 IDECONNECTOR.44 ; also sheet 1,2
IDECS0: IDECONNECTOR.37 ; also sheet 2
IDECS1: IDECONNECTOR.38 ; also sheet 2
IDEINT: IDECONNECTOR.31 ; also sheet 1,2
IDELED: IDECONNECTOR.39
IDEWAIT: IDECONNECTOR.27 ; also sheet 1,2
IOR: IDECONNECTOR.25 ; also sheet 2
IOW: IDECONNECTOR.23 ; also sheet 2
RESET: IDECONNECTOR.1 ; also sheet 1,2
VCC: IDECONNECTOR.41 IDECONNECTOR.42 ; also sheet 1,2
Unconnected: IDECONNECTOR.20 IDECONNECTOR.21 IDECONNECTOR.28 IDECONNECTOR.29 IDECONNECTOR.32 IDECONNECTOR.34

### Buses
VCC33,VCC,GND,CLK7M,A[0..31],D[0..31],IPL[0..2],FC[0..2],DSACK[0..1],BR,BGACK,RW20,CLKCPU,CLKCPU_INT,AS20,DS20,BG20,AVEC,SIZ[0..1],DBEN,BERR,RESET,HALT,BG,VPA,VMA,E,AS,UDS,LDS,DTACK,CPCS,CPSENSE,CDIS,MMUDIS,IOR,IOW,INT2,IDECS[0..1],IDELED,IDEWAIT,IDEINT,RAMOE,RAMCS[0..3],INTSIG[0..4],TCK,TMS,TDI,TDO,TDINT,RAM_MUX

## Power pins joined to a net without a drawn wire
GND: IC1.C05(GND) IC1.C07(GND) IC1.C09(GND) IC1.E03(GND) IC1.E11(GND) IC1.F03(GND) IC1.G03(GND) IC1.G11(GND) IC1.J03(GND) IC1.J11(GND) IC1.L05(GND) IC1.L07(GND) IC1.L08(GND) IC1.L09(GND) IC2.5(GND) IC2.6(GND) IC2.7(GND) IC2.8(GND) IC2.9(GND) IC2.12(GND) IC2.14(GND) IC2.19(GND) IC2.30(GND) IC2.41(GND) IC2.51(GND) IC2.63(GND) IC4.3(GND) IC5.3(GND) IC10.4(GND) IC10.10(GND) IC10.15(GND) IC10.21(GND) IC10.28(GND) IC10.34(GND) IC10.39(GND) IC10.45(GND) X1.16(GND) X1.53(GND)
VCC: IC1.C06(VCC) IC1.D04(VCC) IC1.D10(VCC) IC1.F02(VCC) IC1.F11(VCC) IC1.H03(VCC) IC1.H11(VCC) IC1.K04(VCC) IC1.K10(VCC) IC1.L06(VCC) IC2.10(VCC) IC2.16(VCC) IC2.17(VCC) IC2.27(VCC) IC2.43(VCC) IC2.52(VCC) IC2.53(VCC) IC2.61(VCC) IC4.5(VCC) IC5.5(VCC) IC10.7(VCC) IC10.18(VCC) IC10.31(VCC) IC10.42(VCC) X1.14(VCC) X1.49(VCC)

## Library data of the parts
C1-C15 C18 C31 = microbuilder:CAP_CERAMIC: Ceramic Capacitors 0402 - 0402 Surface Mount Capacitors 16pF 50V 5% [Digikey: 445-4899-2-ND] 18pF 50V 5% [Digikey: 490-1281-2-ND] 22pF 50V 5% [Digikey: 490-1283-2-ND] 68pF 50V 5% [Digikey: 490-1289-2-ND] 0.1uF 10V 10% [Digikey: 490-1318-2-ND] 1.0uF 6.3V 10% [Digikey: 490-1320-2-ND] 0603 - 0603 Surface Mount Capacitors 16 pF 50V 5% [Digikey: 445-5051-2-ND] 22 pF 50V [Digikey: PCC220ACVTR-ND] 33 pF 50V 5% [Digikey: 490-1415-1-ND] 56pF 50V 5% [Digikey: 490-1421-1-ND] 220pF 50V 5% [Digikey: 445-1285-1-ND] 680 pF 50V 2200 pF 50V 5% C0G [Digikey: 445-1297-1-ND] 5600 pF 100V 5% X7R [Digikey: 478-3711-1-ND] 0.1 µF 25V 10% [Digikey: PCC2277TR-ND] 0.22 µF 16V 10% X7R [Digikey: 445-1318-1-ND] 1.0 µF 25V 10% [Digikey: 445-5146-2-ND] 0603 - RF Specific 3pF 250V +/-0.1pF RF [Digikey: 712-1347-1-ND] 18 pF 250V 5% [Digikey: 478-3505-1-ND or 712-1322-1-ND] 56 pF 250V 5% C0G RF [Digikey: 490-4867-1-ND] 68 pF 250V RF [Digikey: 490-4868-1-ND] 0805 - 0805 Surface Mount Capacitors 220 pF 250V 2% RF Ceramic Capacitor [Digikey: 712-1398-1-ND] 1000 pF 50V 2% NP0 Ceramic Capacitor [Digikey: 478-3760-1-ND] 0.1 µF 25V 10% Ceramic Capacitor [Digikey: PCC1828TR-ND] 1.0 µF 16V 10% Ceramic Capacitor[Digikey: 490-1691-2-ND] 10.0 µF 10V 10% Ceramic Capacitor[Digikey: 709-1228-1-ND] 10.0 uF 16V 10% Ceramic Capacitor [Digikey: 478-5165-2-ND] 47 uF 6.3V 20% Ceramic Capacitor [Digikey: 587-1779-1-ND or 399-5506-1-ND] 1206 - 1206 Surface Mount Capacitors 47uF 10V 20% Ceramic Capacitor [Digikey: 490-5528-1-ND or 399-5508-1-ND or 445-6010-1-ND] 100uF 6.3V -20%, +80% Y5V Ceramic Capacitor (Digikey: 490-4512-1-ND, Mouser: 81-GRM31CF50J107ZE1L)
C16 C17 C20 = SparkFun-Capacitors:0.1UF-25V(+80/-20%)(0603): CAP-00810 Ceramic Standard decoupling cap; PROD_ID: CAP-00810
C19 = eagle-ltspice:C: CAPACITOR, European symbol; SPICEMODEL: NONE; SPICEPREFIX: C
C21-C30 = adafruit:C-US: CAPACITOR, American symbol
IC1 = micro-mc68000:MC68030RC: 68xxx PROCESSOR; MF: MOTOROLA; MPN: MC68030RC50C; OC_FARNELL: unknown; OC_NEWARK: 52F3269
IC2 = micro-mc68000:MC68881FN: 68xxx PROCESSOR; OC_FARNELL: unknown; OC_NEWARK: unknown
IC3 = SparkFun-PowerIC:V_REG_LM1117: Voltage Regulator LM1117 Standard adjustable voltage regulator but in SMD form. Spark Fun Electronics SKU : COM-00595; PROD_ID: VREG-08170
IC4 IC5 = 74xx-little-de:74*1G17: Single Schmitt-Trigger Buffer
IC6-IC9 = terriblefire:AS6C8008
IC10 = 74ac-logic:74AC16245: 16-bit BUS TRANSCEIVER, 3-state
IDECONNECTOR = Hermes_development:87758-4416: 44 Pin - 2mm Dual Row Single Wafer, Vertical T/H HDR Source: http://www.molex.com/pdm_docs/sd/877580616_sd.pdf; MF: MOLEX; MPN: 87758-4416; OC_FARNELL: unknown; OC_NEWARK: 59J1588
INT2 SPI_INT = pinhead:PINHD-1X1: PIN HEADER
JP1 = SparkFun-Retired:JUMPER-3
JP3 JP5 PWR1 = SparkFun-Retired:JUMPER-2: Jumper Basic 0.1" spaced jumper. Use with breakaway headers.
JTAG = microbuilder:HEADER-1X6: PIN HEADER
OSCCPU = microbuilder:OSCILLATOR: Oscillators 3.2x2.5mm SMT 4.0MHz +/- 50ppm, 3.3V, 9mA, -40/+85°C - Digikey: 535-9752-1-ND 50MHz +/- 50ppm, 3.3V, 8mA, -10/+70°C - Digikey: 478-4792-1-ND 5x7mm SMT 4.0MHz +/-20ppm 3.3V, 20mA, -20/+70°C - Digikey: 535-9329-2-ND 50MHz +/- 25ppm 3.3V, 35mA, -40/+85°C - Digikey: 631-1197-1-ND
R1 R2 = SparkFun-Resistors:0.05OHM-1/5W-1%(0603); PROD_ID: RES-12535
R3 = microbuilder:RESISTOR: Resistors 0402 - 0402 Surface Mount Package 22 Ohm 1% 1/16W [Digikey: 311-22.0LRTR-ND] 33 Ohm 5% 1/16W 1.0K 5% 1/16W 1.5K 5% 1/16W 2.0K 1% 1/16W 10.0K 1% 1/16W [Digikey: 311-10.0KLRTR-ND] 10.0K 5% 1/16W [Digikey: RMCF0402JT10K0TR-ND] 12.1K 1% 1/16W [Digikey: 311-22.0LRTR-ND] 100.0K 5% 1/16W 0603 - 0603 Surface Mount Package 0 Ohm 1/10 Watt 1% Resistor 15 Ohm 1/10 Watt 1% Resistor 33 Ohm 1/10 Watt 1% Resistor 49.9 Ohm 1/10 Watt 1% Resistor 100 Ohm 1/10 Watt 1% Resistor 150 Ohm 1/10 Watt 1% Resistor 240 Ohm 1/10 Watt 1% Resistor 390 Ohm 1/10 Watt 1% Resistor 560 Ohm 1/10 Watt 1% Resistor 680 Ohm 1/10 Watt 1% Resistor 750 Ohm 1/10 Watt 1% Resistor 1.0K Ohm 1/10 Watt 1% Resistor 1.5K Ohm 1/10 Watt 1% Resistor 2.0K Ohm 1/10 Watt 1% Resistor 2.2K Ohm 1/10 Watt 1% Resistor 3.3K Ohm 1/10 Watt 1% Resistor 4.7K Ohm 1/10 Watt 1% Resistor 10.0K Ohm 1/10 Watt 1% Resistor 12.0K Ohm 1/10 Watt 1% Resistor 12.1K Ohm 1/10 Watt 1% Resistor 20.0K Ohm 1/10 Watt 1% Resistor 33.0K Ohm 1/10 Watt 1% Resistor 100.0K Ohm 1/10 Watt 1% Resistor 0805 - 0805 Surface Mount Package 0 Ohm 1/8 Watt 1% Resistor 33 Ohm 1/8 Watt 1% Resistor 100 Ohm 1/8 Watt 1% Resistor 150 Ohm 1/8 Watt 1% Resistor 200 Ohm 1/8 Watt 1% Resistor 240 Ohm 1/8 Watt 1% Resistor 330 Ohm 1/8 Watt 1% Resistor 390 Ohm 1/8 Watt 1% Resistor 470 Ohm 1/8 Watt 1% Resistor 1.0K Ohm 1/8 Watt 1% Resistor 1.5K Ohm 1/8 Watt 1% Resistor 2.0K Ohm 1/8 Watt 1% Resistor 4.7K Ohm 1/8 Watt 1% Resistor 5.1K Ohm 1/8 Watt 1% Resistor 5.6K Ohm 1/8 Watt 1% Resistor 10.0K Ohm 1/8 Watt 1% Resistor 22.0K Ohm 1/8 Watt 1% Resistor 33.0K Ohm 1/8 Watt 1% Resistor 100K Ohm 1/8 Watt 1% Resistor 1206 - 1206 Surface Mount Package 2012 - 2010 Surface Mount Package 0.11 Ohm 1/2 Watt 1% Resistor - Digikey: RHM.11UCT-ND
RN1-RN3 = CAY16-103J4LF:CAY16-103J4LF: Res Thick Film Array 10K Ohm 5% 200ppm/C ISOL Molded 8-Pin 1206(4 X 0603) Convex SMD Paper T/R; AVAILABILITY: Good; DESCRIPTION: Res Thick Film Array 10K Ohm 5% ?200ppm/C ISOL Molded 8-Pin 1206(4 X 0603) Convex SMD Paper T/R; MF: Bourns; MP: CAY16-103J4LF; PACKAGE: 1206 Bourns; PRICE: 0.02 USD
SPIPORT = pinhead:PINHD-2X6: PIN HEADER
U1 = SparkFun-IC-Memory:SPI_FLASH-X25XX: 32M Serial Flash Memory 8pin SPI Flash series x25xx. Works with devices like W25X32 and BR25L32 Datasheet <http://www.macronix.com/Lists/Datasheet/Attachments/5031/MX25L3206E,%203V,%2032Mb,%20v1.5.pdf> SparkFun Products SparkFun Venus GPS Logger <https://www.sparkfun.com/products/10920> (GPS-10920); PROD_ID: N/A; VALUE: 32M SPI Flash
X1 = terriblefire:MC68000P: 68xxx PROCESSOR; OC_FARNELL: unknown; OC_NEWARK: unknown
XC9572XL(BUS) = SL530:TERRIBLEFIRE_XC9572XL-VQ64
XC95144XL(RAM) = terriblefire:XC95144XL-TQ100